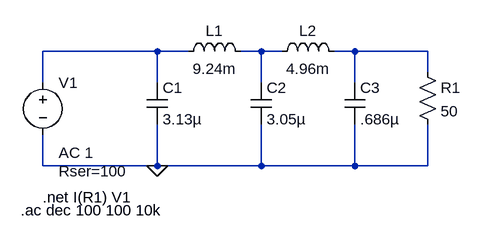
[diagram p0: schematic spar equalizer.asc]
spar equalizer.asc, the LTspice schematic file:
Version 4
SHEET 1 880 680
WIRE 112 64 -64 64
WIRE 160 64 112 64
WIRE 272 64 240 64
WIRE 304 64 272 64
WIRE 416 64 384 64
WIRE 528 64 416 64
WIRE 528 96 528 64
WIRE -64 112 -64 64
WIRE 112 112 112 64
WIRE 272 112 272 64
WIRE 416 112 416 64
WIRE -64 240 -64 192
WIRE 112 240 112 176
WIRE 112 240 -64 240
WIRE 272 240 272 176
WIRE 272 240 112 240
WIRE 416 240 416 176
WIRE 416 240 272 240
WIRE 528 240 528 176
WIRE 528 240 416 240
FLAG 112 240 0
SYMBOL voltage -64 96 R0
WINDOW 123 24 124 Left 2
WINDOW 39 24 152 Left 2
SYMATTR InstName V1
SYMATTR Value ""
SYMATTR Value2 AC 1
SYMATTR SpiceLine Rser=100
SYMBOL cap 96 112 R0
SYMATTR InstName C1
SYMATTR Value 3.13µ
SYMBOL cap 256 112 R0
SYMATTR InstName C2
SYMATTR Value 3.05µ
SYMBOL cap 400 112 R0
SYMATTR InstName C3
SYMATTR Value .686µ
SYMBOL ind 144 80 R270
WINDOW 0 32 56 VTop 2
WINDOW 3 5 56 VBottom 2
SYMATTR InstName L1
SYMATTR Value 9.24m
SYMBOL ind 288 80 R270
WINDOW 0 32 56 VTop 2
WINDOW 3 5 56 VBottom 2
SYMATTR InstName L2
SYMATTR Value 4.96m
SYMBOL res 512 80 R0
SYMATTR InstName R1
SYMATTR Value 50
TEXT -64 288 Left 2 !.net I(R1) V1
TEXT -98 308 Left 2 !.ac dec 100 100 10k

The netlist it stands for:
* spar equalizer.asc
V1 N001 0 AC 1 Rser=100
C1 N001 0 3.13µ
C2 N002 0 3.05µ
C3 N003 0 .686µ
L1 N001 N002 9.24m
L2 N002 N003 4.96m
R1 N003 0 50
.net I(R1) V1
.ac dec 100 100 10k
.backanno
.end